# EasyEDA Pro project CyberryPotter-6050-v4.0.eprj, board PCB_IR
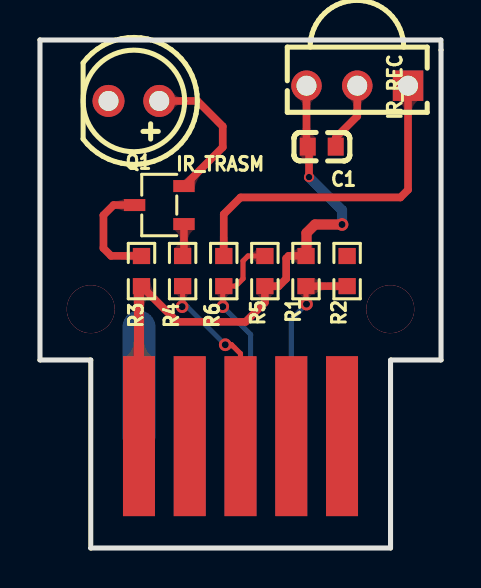
[diagram p10: board, top side]
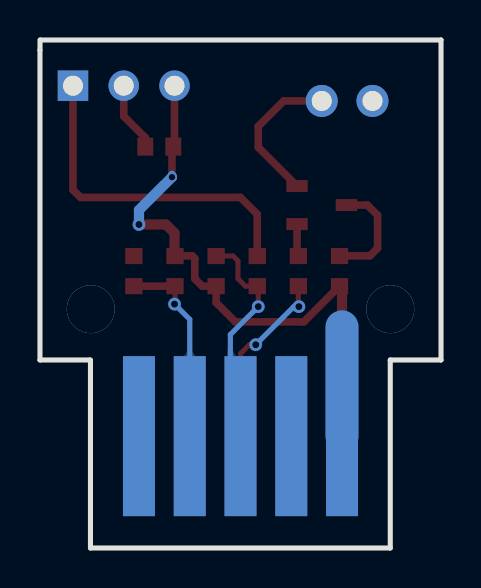
[diagram p11: board, bottom side, seen from below]

Outline 20.07 x 25.41 mm; copper layers: Top Layer, Bottom Layer. Coordinates in mm from the lower left corner of the outline.
Outline path: 0,25.41 0,9.4 2.54,9.4 2.54,0 17.54,0 17.54,9.38 17.56,9.4 20.07,9.4 20.07,24.9 20.06,25.41 0,25.41
Stack: Top Layer 0.035mm / Dielectric1 1.51mm FR4 er 4.5 / Bottom Layer 0.035mm

## Design rules (mm)
template: JLCPCB Capability(Two Layers Board)
spacing copperThickness1oz (default): track to track 0.102, other pairs 0.152 to 0.3
spacing copperThickness2oz: track to track 0.203, other pairs 0.152 to 0.3
track width copperThickness1oz (default): min 0.127, default 0.254, max 2.54
track width copperThickness2oz: min 0.203, default 0.254, max 2.54
differential pair differentialPair (default): width min 0.127, default 0.254, max 2.54; gap min 0.152, default 0.152
via viaSize (default): diameter min 0.5, default 0.61, max 10; hole min 0.3, default 0.305, max 6.3

## Placement (name value [footprint] x y rotation side)
C1  100nF 0603  [C0603]  14.1 20.07 180 top
IR_REC  XL-IRM1838D  [OPTO-TH_3P-L7.0-W5.6-P2.54-L]  15.88 23.12 180 top
IR_TRASM  IR333C  [LED-TH_BD5.0-P2.54-FD]  4.7 22.36 180 top
NOREF  -  [Pad_e12]  4.95 5.59 0 top
NOREF#2  -  [Pad_e28]  12.57 5.59 0 top
NOREF#3  -  [Pad_e25]  4.95 5.59 0 top
NOREF#4  -  [Pad_e27]  10.03 5.59 0 top
NOREF#5  -  [Pad_e26]  7.49 5.59 0 top
NOREF#6  -  [Pad_e17]  15.11 5.59 0 top
NOREF#7  -  [Pad_e15]  10.03 5.59 0 top
NOREF#8  -  [Pad_e29]  15.11 5.59 0 top
NOREF#9  -  [Pad_e14]  7.49 5.59 0 top
NOREF#10  -  [Pad_e16]  12.57 5.59 0 top
Q1  S8050  [SOT-23-3_L2.9-W1.6-P1.90-LS2.8-BR]  5.97 17.15 0 top
R1  910KΩ 0603  [R0603]  13.31 13.85 90 top
R2  91KΩ 0603  [R0603]  15.37 13.85 270 top
R3  100Ω 0603  [R0603]  5.08 13.85 270 top
R4  1kΩ 0603  [R0603]  7.14 13.85 90 top
R5  4.7KΩ 0603  [R0603]  11.25 13.85 90 top
R6  100Ω 0603  [R0603]  9.19 13.85 90 top

## Footprints (pads in the part's own frame, mm; a bottom-side part is the same pattern mirrored in y, then rotated)
C0603
  rect 0.8x0.9 smd: 1(-0.7,0) 2(0.7,0)
LED-TH_BD5.0-P2.54-FD
  round 1.6 hole 1: 1(-1.27,0) 2(1.27,0)
OPTO-TH_3P-L7.0-W5.6-P2.54-L
  rect 1.524x1.524 hole 1: 1(-2.54,0)
  round 1.524 hole 1: 2(0,0) 3(2.54,0)
Pad_e12
  rect 1.6x8 smd: 4(0,0)
Pad_e14
  rect 1.6x8 smd: 4(0,0)
Pad_e15
  rect 1.6x8 smd: 4(0,0)
Pad_e16
  rect 1.6x8 smd: 4(0,0)
Pad_e17
  rect 1.6x8 smd: 4(0,0)
Pad_e25
  rect 1.6x8 smd far side: 4(0,0)
Pad_e26
  rect 1.6x8 smd far side: 4(0,0)
Pad_e27
  rect 1.6x8 smd far side: 4(0,0)
Pad_e28
  rect 1.6x8 smd far side: 4(0,0)
Pad_e29
  rect 1.6x8 smd far side: 4(0,0)
R0603
  rect 0.806x0.864 smd: 1(-0.753,0) 2(0.753,0)
SOT-23-3_L2.9-W1.6-P1.90-LS2.8-BR
  rect 1.07x0.6 smd: 1(1.235,-0.95) 2(1.235,0.95) 3(-1.235,0)

## Nets
3V3: C1.2 IR_REC.3 NOREF.4 R1.2 R3.2 R5.1
GND: C1.1 IR_REC.2 IR_TRASM.2 NOREF#3.4 R2.1
PA4: NOREF#9.4
PA5: NOREF#5.4
PA6: NOREF#7.4 R4.1
PA7: NOREF#4.4 R5.2 R6.1
PB0: NOREF#8.4
PB1: NOREF#2.4 R1.1 R2.2
PB10: NOREF#10.4
PB11: NOREF#6.4
$1N195: IR_TRASM.1 Q1.2
$1N793: Q1.1 R4.2
$1N835: Q1.3 R3.1
$1N1035: IR_REC.1 R6.2

## Via types
v1: diameter 2.4, hole 2.4, Top Layer to Bottom Layer, 2 vias
v2: diameter 0.635, hole 0.355, Top Layer to Bottom Layer, 5 vias
v3: diameter 0.508, hole 0.33, Top Layer to Bottom Layer, 1 via

## Routing (per net, layer and track width the routed paths; a pad name or vN(x,y) marks a point on that pad's centre or on a via; arc(x,y) is an arc through that point)
3V3: length 29.5
  Top Layer w0.381: IR_REC.3 13.34,20.13 13.46,20.01 v3(13.46,18.55) ; R5.1 11.95,13.1 12.32,13.47 12.32,14.48 12.45,14.61 13.3,14.61 R1.2 ; 11.25,12.71 11.25,12.27 10.29,11.31 6.87,11.31 R3.2
  Top Layer w0.508: R1.2 13.34,14.63 13.34,15.75 13.76,16.18 v2(15.11,16.18) ; NOREF.4 4.95,12.97 R3.2
  Bottom Layer w0.381: 13.46,18.67 v3(13.46,18.55)
  Bottom Layer w0.508: v3(13.46,18.55) 15.11,16.9 v2(15.11,16.18)
GND: length 9
  Top Layer w0.381: C1.1 14.8,20.52 15.88,21.6 IR_REC.2
  Bottom Layer w1.651: NOREF#3.4 4.95,11.06
(no net):
  vias: v1(2.54,11.94) v1(17.53,11.94)
PA6: length 9.1
  Top Layer w0.254: R4.1 7.14,12.1 v2(7.11,12.07) ; NOREF#7.4 10.03,9.72 9.59,10.17 v2(9.27,10.17)
  Bottom Layer w0.254: v2(7.11,12.07) 7.37,12.07 v2(9.27,10.17)
PA7: length 11.5
  Top Layer w0.254: v2(9.14,12.07) 9.14,13.05 R6.1 9.79,13.1 10.16,13.47 10.16,14.36 10.41,14.6 R5.2
  Bottom Layer w0.254: v2(9.14,12.07) 10.54,10.67 10.54,6.1 NOREF#4.4
PB1: length 9.9
  Top Layer w0.254: R1.1 13.31,12.22 v2(13.34,12.2)
  Top Layer w0.381: R2.2 R1.1
  Bottom Layer w0.254: NOREF#2.4 12.57,11.44 v2(13.34,12.2)
$1N195: length 7.5
  Top Layer w0.381: Q1.2 9.14,20.04 9.14,21.09 7.87,22.36 5.97,22.36
$1N793: length 1.6
  Top Layer w0.381: R4.2 7.2,14.67 Q1.1
$1N835: length 5.5
  Top Layer w0.381: R3.1 5.07,14.61 3.56,14.61 3.18,14.99 3.18,16.64 3.68,17.15 Q1.3
$1N1035: length 17
  Top Layer w0.381: IR_REC.1 18.41,17.91 18.03,17.53 10.03,17.53 9.19,16.69 R6.2

## Copper pours and planes (outline as drawn; the poured copper is in the pictures)
GND on Top Layer: -0.13,25.53 20.45,25.53 20.45,9.66 -0.13,9.66
GND on Bottom Layer: -2.79,26.04 22.35,26.04 22.35,9.66 -2.79,9.66

Small or netless copper shapes (teardrops, artwork), in the pictures only: 29 on Top Layer, 6 on Bottom Layer
